# Altium schematic sheet TWindow.SchDoc: LiveDesign Evaluation - Stop Watch
size A4; Organization: Altium Limited; Address1: L3, 12a Rodborough Rd; Address2: Frenchs Forest; Address3: NSW; Address4: Australia 2086; DocumentNumber: 7; SheetNumber: 7; SheetTotal: 7
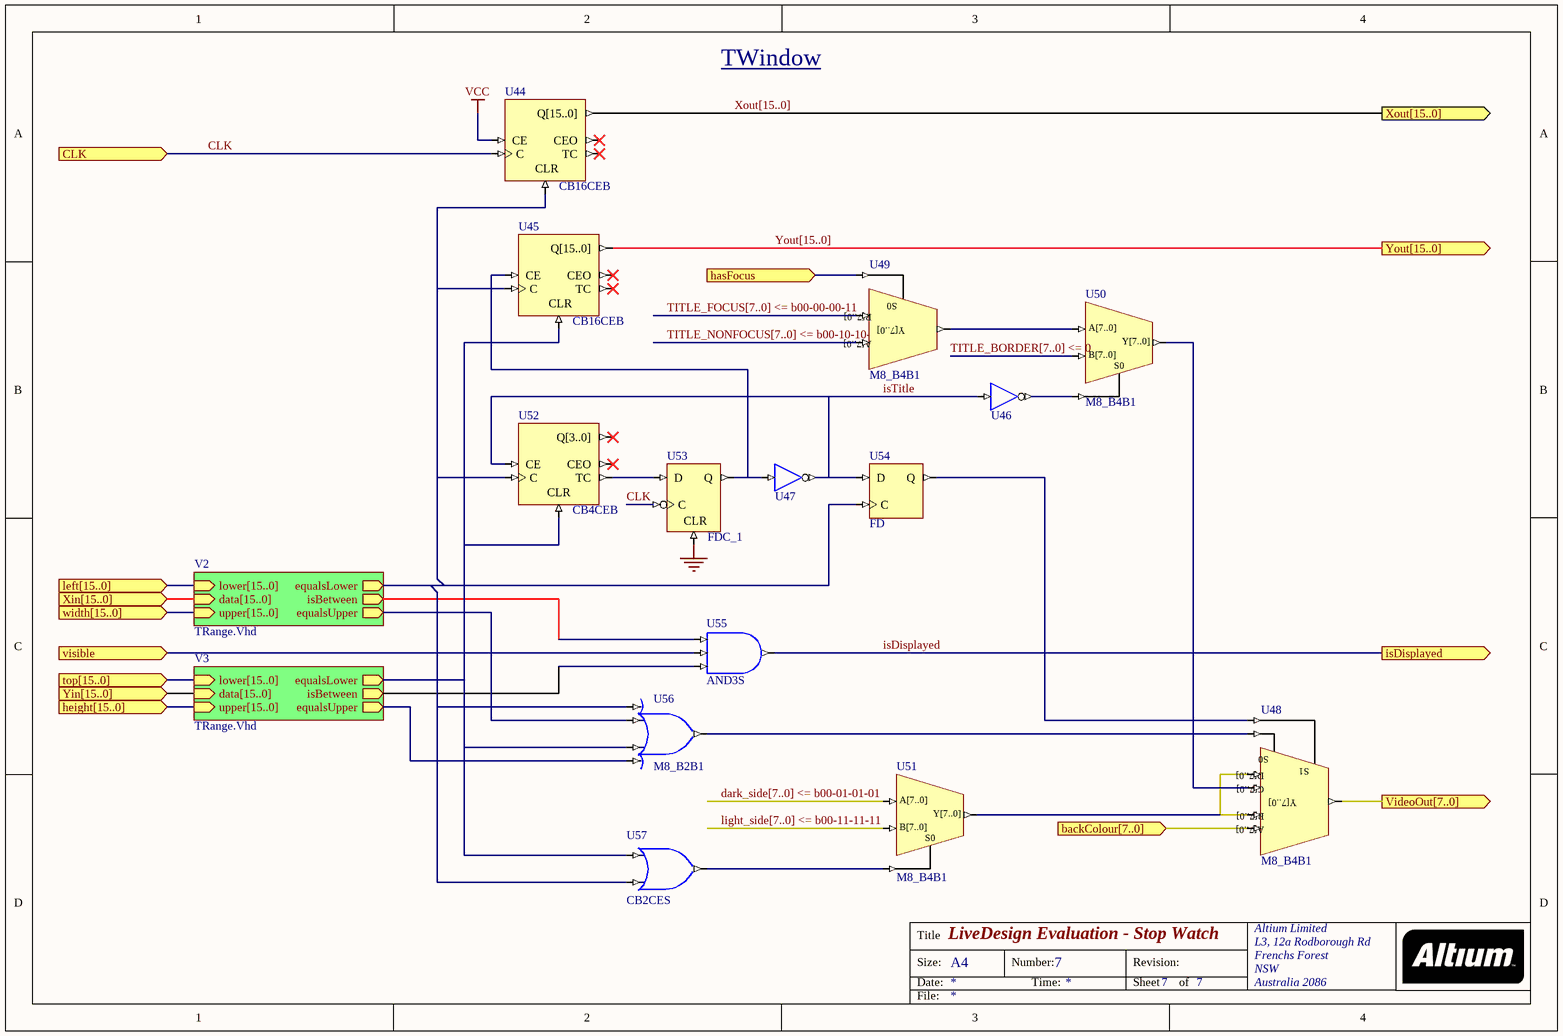
[diagram p0: TWindow.SchDoc]

## Parts
U44  CB16CEB
U45  CB16CEB
U46  INV  (value not drawn)
U47  INV  (value not drawn)
U48  M8_B4B1
U49  M8_B4B1
U50  M8_B4B1
U51  M8_B4B1
U52  CB4CEB
U53  FDC_1
U54  FD
U55  AND3S
U56  M8_B2B1
U57  CB2CES

## Sub-sheets
V2 = TRange.Vhd: lower[15..0] (in), data[15..0] (in), upper[15..0] (in), isBetween (out), equalsLower (out), equalsUpper (out)
V3 = TRange.Vhd: lower[15..0] (in), data[15..0] (in), upper[15..0] (in), isBetween (out), equalsLower (out), equalsUpper (out)

## Ports
backColour[7..0] (in), CLK (in), hasFocus (in), height[15..0] (in), isDisplayed (out), left[15..0] (in), top[15..0] (in), VideoOut[7..0] (out), visible (in), width[15..0] (in), Xin[15..0] (in), Xout[15..0] (out), Yin[15..0] (in), Yout[15..0] (out)

## Nets
GND: U53.CLR
VCC: U44.CE
backColour[7..0]: U48.A[7..0] ; port backColour[7..0]
CLK: U44.C U53.C ; port CLK
dark_side[7..0] <= b00-01-01-01: U51.A[7..0]
hasFocus: U49.S0 ; port hasFocus
isDisplayed: U55.O ; port isDisplayed
isTitle: U46.I U47.O U52.CE U54.D
light_side[7..0] <= b00-11-11-11: U51.B[7..0]
TITLE_BORDER[7..0] <= 0: U50.B[7..0]
TITLE_FOCUS[7..0] <= b00-00-00-11: U49.B[7..0]
TITLE_NONFOCUS[7..0] <= b00-10-10-10: U49.A[7..0]
VideoOut[7..0]: U48.Y[7..0] ; port VideoOut[7..0]
visible: U55.I1 ; port visible
Xout[15..0]: U44.Q[15..0] ; port Xout[15..0]
Yout[15..0]: U45.Q[15..0] ; port Yout[15..0]
NetU44_CLR: U44.CLR U45.C U52.C U54.C U56.I0 U57.I1 ; sheet V2/equalsLower
NetU45_CE: U45.CE U47.I U53.Q
NetU45_CLR: U45.CLR U52.CLR U56.I2 U57.I0 ; sheet V3/equalsLower
NetU46_O: U46.O U50.S0
NetU48_B[7..0]: U48.B[7..0] U48.D[7..0] U51.Y[7..0]
NetU48_C[7..0]: U48.C[7..0] U50.Y[7..0]
NetU48_S0: U48.S0 U56.O
NetU48_S1: U48.S1 U54.Q
NetU49_Y[7..0]: U49.Y[7..0] U50.A[7..0]
NetU51_S0: U51.S0 U57.O
NetU52_TC: U52.TC U53.D
NetU55_I0: U55.I0 ; sheet V2/isBetween
NetU55_I2: U55.I2 ; sheet V3/isBetween
NetU56_I1: U56.I1 ; sheet V2/equalsUpper
NetU56_I3: U56.I3 ; sheet V3/equalsUpper

Not connected (* = marked no-connect by the designer): U44 CEO* TC*; U45 CEO* TC*; U52 CEO* Q[3..0]*

## Buses and harness runs
bus dark_side[7..0] <= b00-01-01-01
bus light_side[7..0] <= b00-11-11-11
bus port height[15..0] = sheet V3/upper[15..0]
bus port left[15..0] = sheet V2/lower[15..0]
bus port top[15..0] = sheet V3/lower[15..0]
bus port width[15..0] = sheet V2/upper[15..0]
bus port Xin[15..0] = sheet V2/data[15..0]
bus port Yin[15..0] = sheet V3/data[15..0]
bus TITLE_BORDER[7..0] <= 0
bus TITLE_FOCUS[7..0] <= b00-00-00-11
bus TITLE_NONFOCUS[7..0] <= b00-10-10-10
bus Xout[15..0] = port Xout[15..0]
bus Yout[15..0] = port Yout[15..0]

## Notes on the sheet
- TWindow
- Title
- Size:
- Date:
- A4
- Number:
- Time:
- Revision:
- Sheet
- of
- File:

## Library data of the parts
U44 U45 = CB16CEB: 16-Bit Cascadable Binary Counters with Clock Enable and Asynchronous Clear, Bus Version; Xilinx Equivalent: CB16CE; ArchiveName: GENERIC; VHDLIB_SIM: GENERIC_LIB; Published: 29-Jan-2004; Publisher: Altium Limited; Core Revision: 1.00.00
U46 U47 = INV: Inverter; ArchiveName: GENERIC; VHDLIB_SIM: GENERIC_LIB; Published: 29-Jan-2004; Publisher: Altium Limited; Xilinx Equivalent: INV; Core Revision: 1.00.00
U48 = M8_B4B1: 4x8-Bit Bus to 1x8-Bit Bus Multiplexer; ArchiveName: GENERIC; VHDLIB_SIM: GENERIC_LIB; Published: 29-Jan-2004; Publisher: Altium Limited; Core Revision: 1.00.00
U49-U51 = M8_B2B1: 2x8-Bit Bus to 1x8-Bit Bus Multiplexer; ArchiveName: GENERIC; VHDLIB_SIM: GENERIC_LIB; Published: 29-Jan-2004; Publisher: Altium Limited; Core Revision: 1.00.00
U52 = CB4CEB: 4-Bit Cascadable Binary Counters with Clock Enable and Asynchronous Clear, Bus Version; ArchiveName: GENERIC; VHDLIB_SIM: GENERIC_LIB; Published: 29-Jan-2004; Publisher: Altium Limited; Core Revision: 1.00.00
U53 = FDC_1: D-Type Negative Edge Flip-Flop with Asynchronous Clear; ArchiveName: GENERIC; VHDLIB_SIM: GENERIC_LIB; Published: 29-Jan-2004; Publisher: Altium Limited; Xilinx Equivalent: FDC_1; Core Revision: 1.00.00
U54 = FD: D-Type Flip-Flop; ArchiveName: GENERIC; VHDLIB_SIM: GENERIC_LIB; Published: 29-Jan-2004; Publisher: Altium Limited; Xilinx Equivalent: FD; Core Revision: 1.00.00
U55 = AND3S: 3-Input AND Gate, Single Pin Version; Xilinx Equivalent: AND3; ArchiveName: GENERIC; VHDLIB_SIM: GENERIC_LIB; Published: 29-Jan-2004; Publisher: Altium Limited; Core Revision: 1.00.00
U56 = OR4S: 4-Input OR Gate, Single Pin Version; Xilinx Equivalent: OR4; ArchiveName: GENERIC; VHDLIB_SIM: GENERIC_LIB; Published: 29-Jan-2004; Publisher: Altium Limited; Core Revision: 1.00.00
U57 = OR2S: 2-Input OR Gate, Single Pin Version; Xilinx Equivalent: OR2; ArchiveName: GENERIC; VHDLIB_SIM: GENERIC_LIB; Published: 29-Jan-2004; Publisher: Altium Limited; Core Revision: 1.00.00